# Altium schematic sheet Sheet1.SchDoc
size A4
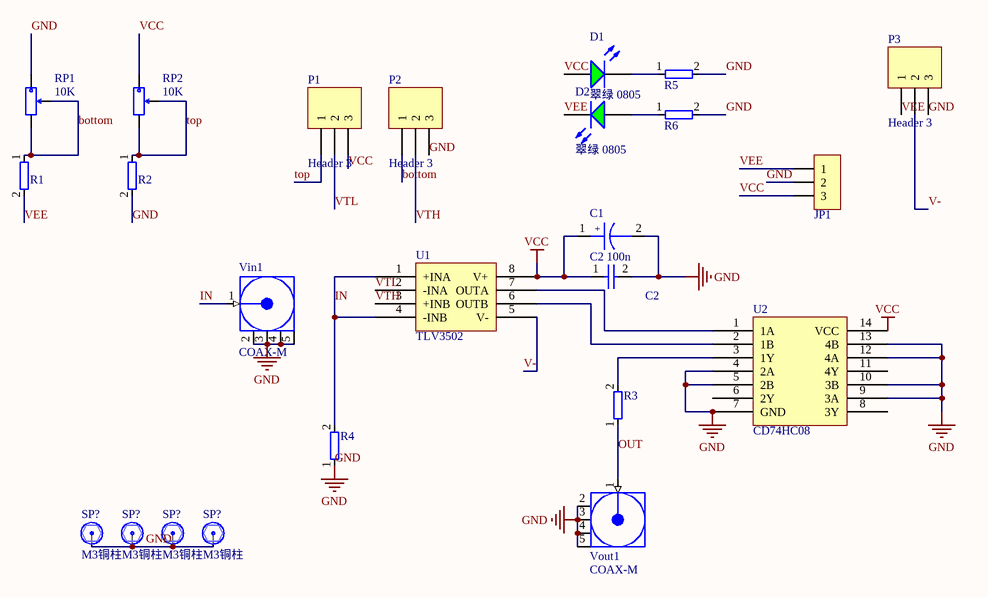
[diagram p0: Sheet1.SchDoc]

## Parts
(Parts that share a designator on the sheet are numbered #1, #2 ... from top to bottom, then left to right.)
C1  C2 100n  [0603_C]
C2  CAP  [0603_C]  (value not drawn)
D1  翠绿 0805  [0805_LED_S1]
D2  翠绿 0805  [0805_LED_S1]
JP1  HDR-1X3  [XH2.54-WI-3P]  (value not drawn)
P1  Header 3  [HDR1X3]
P2  Header 3  [HDR1X3]
P3  Header 3  [HDR1X3]
R1  RES  [0805_R]  (value not drawn)
R2  RES  [0805_R]  (value not drawn)
R3  RES  [0805_R]  (value not drawn)
R4  RES  [0805_R]  (value not drawn)
R5  RES  [0805_R]  (value not drawn)
R6  RES  [0805_R]  (value not drawn)
RP1  10K  [3303W]
RP2  10K  [3303W]
SP?#1  M3铜柱  [M3x4_L]
SP?#2  M3铜柱  [M3x4_L]
SP?#3  M3铜柱  [M3x4_L]
SP?#4  M3铜柱  [M3x4_L]
U1  TLV3502  [SOP8_N]
U2  CD74HC08  [SOP14_N]
Vin1  COAX-M  [sma-KE]
Vout1  COAX-M  [SMA-KE]

## Nets
GND: C1.2 C2.2 JP1.2 P2.3 P3.3 R2.2 R4.1 R5.2 R6.2 RP1.1 SP?#1.1 SP?#2.1 SP?#3.1 SP?#4.1 U2.4(2A) U2.5(2B) U2.7(GND) U2.9(3A) U2.10(3B) U2.12(4A) U2.13(4B) Vin1.2(GND) Vin1.3(GND) Vin1.4(GND) Vin1.5(GND) Vout1.2(GND) Vout1.3(GND) Vout1.4(GND) Vout1.5(GND)
VCC: C1.1 C2.1 D1.A JP1.3 P1.3 RP2.1 U1.8(V+) U2.14(VCC)
bottom: P2.1 R1.1 RP1.2 RP1.3
IN: R4.2 U1.1(+INA) U1.4(-INB) Vin1.1(Signal)
OUT: R3.1 Vout1.1(Signal)
top: P1.1 R2.1 RP2.2 RP2.3
V-: P3.2 U1.5(V-)
VEE: D2.K JP1.1 P3.1 R1.2
VTH: P2.2 U1.3(+INB)
VTL: P1.2 U1.2(-INA)
NetD1_K: D1.K R5.1
NetD2_A: D2.A R6.1
NetR3_2: R3.2 U2.3(1Y)
NetU1_6: U1.6(OUTB) U2.2(1B)
NetU1_7: U1.7(OUTA) U2.1(1A)

Not connected (* = marked no-connect by the designer): U2 6(2Y) 8(3Y) 11(4Y)

## Notes on the sheet
- (in symbol CAP1) +

## Library data of the parts
C1 = CAP1
D1 D2 = 0805 翠绿: 发光二极管; ComponentLink1Description: 供应商链接; ComponentLink1URL: http://www.szlcsc.com/product/details_2670.html; Package: 0805; Supplier: LC; SuppliersPartNumber: C2297
JP1 = Header 3: 3P接插件; BOM名称: 3P接插件
P1-P3 = Header 3: Header, 3-Pin; LatestRevisionDate: 17-Jul-2002; LatestRevisionNote: Re-released for DXP Platform.; Publisher: Altium Limited
RP1 RP2 = RP-SMD: 贴片电位器; BOM名称: 贴片电位器
SP?#1-SP?#4 = 铜柱小焊盘: 铜柱; BOM名称: 铜柱
Vin1 Vout1 = COAX-M: RF Coaxial PCB Connector, MMCX; Thru-Hole, Vertical Mount Plug,  50 Ohm Impedance; PackageDocument: Rev. A, 16-Jun-1997; PCB_Layout: Complies with manufacturer's recommendation.; DrillSize: Corresponds to nominal value.; Published: 15-Jul-2004; LatestRevisionDate: 15-Jul-2004; LatestRevisionNote: Component Replaced.; DatasheetDocument: 30-May-2003; PackageReference: 908-21103; Publisher: Altium Limited; ComponentLink1Description: Manufacturer Link; ComponentLink1URL: http://www.amphenolrf.com/